# Altium schematic sheet peripherals.schdoc
size 268 x 72 mm
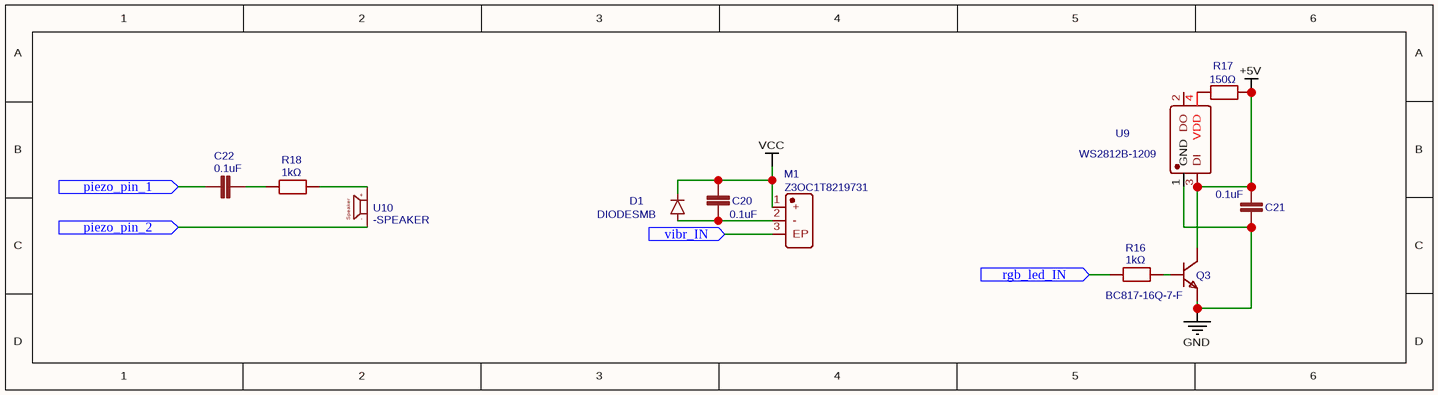
[diagram p0: peripherals.schdoc]

## Parts
C20  0.1uF  [0603-CAP]
C21  0.1uF  [0603-CAP]
C22  0.1uF  [0603-CAP]
D1  DIODESMB  [SMB-DIODE]
M1  Z3OC1T8219731  [VIBRATING-MOTOR-SMD_3P-C9900001680]
Q3  BC817-16Q-7-F  [SOT-23-3_L2.9-W1.3-P1.90-LS2.4-BR]
R16  1kΩ  [R0603]
R17  150Ω  [R0603]
R18  1kΩ  [R0603]
U9  WS2812B-1209  [LED-SMD_4P-L3.2-W2.7-TL-WS2812B-1209]
U10  -SPEAKER  [SPEAKER]

## Ports
piezo_pin_1 (in), piezo_pin_2 (in), rgb_led_IN (in), vibr_IN (in)

## Nets
+5V: C21.1 Q3.3(C) R17.2 U9.3(DI)
GND: C21.2 Q3.2(E) U9.1(GND)
VCC: C20.1 D1.C M1.1(+)
piezo_pin_1: C22.1 ; port piezo_pin_1
piezo_pin_2: U10.NEG ; port piezo_pin_2
rgb_led_IN: R16.2 ; port rgb_led_IN
vibr_IN: M1.3(EP) ; port vibr_IN
NetC20_2: C20.2 D1.A M1.2(-)
NetC22_2: C22.2 R18.2
NetQ3_1: Q3.1(B) R16.1
NetR17_1: R17.1 U9.4(VDD)
NetR18_1: R18.1 U10.POS

Not connected (* = marked no-connect by the designer): U9 2(DO)

## Notes on the sheet
- (in symbol -SPEAKER) +; Speaker; -

## Library data of the parts
C20-C22 = 0.1uF: description: CAP-00810; Contributor: SparkFun; spicePre: C; spiceSymbolName: 0.1UF-25V(+80_-20%)(0603)
D1 = DIODESMB: description: Diode; Contributor: SparkFun; spicePre: D; spiceSymbolName: DIODESMB
M1 = Z3OC1T8219731: BOM_Manufacturer: KOTL(金龙机电); Contributor: LCSC; BOM_Supplier: LCSC; BOM_Supplier Part: C2894731; BOM_Manufacturer Part: Z3OC1T8219731; BOM_JLCPCB Part Class: Extended Part; spicePre: M; spiceSymbolName: Z3OC1T8219731
Q3 = BC817-16Q-7-F: BOM_Manufacturer: Diodes Incorporated; Contributor: LCSC; BOM_Supplier: LCSC; BOM_Supplier Part: C526459; BOM_Manufacturer Part: BC817-16Q-7-F; BOM_JLCPCB Part Class: Extended Part; spicePre: Q; spiceSymbolName: BC817-16Q-7-F
R16 R18 = 1kΩ: BOM_Manufacturer: Resistor.Today; BOM_Manufacturer Part: TCTR0603F47K0F3960T; Contributor: LCSC; BOM_Supplier: LCSC; BOM_Supplier Part: C525388; BOM_JLCPCB Part Class: Extended Part; spicePre: R; spiceSymbolName: TCTR0603F47K0F3960T
R17 = 150Ω: BOM_Manufacturer: Resistor.Today; BOM_Manufacturer Part: TCTR0603F47K0F3960T; Contributor: LCSC; BOM_Supplier: LCSC; BOM_Supplier Part: C525388; BOM_JLCPCB Part Class: Extended Part; spicePre: R; spiceSymbolName: TCTR0603F47K0F3960T
U9 = WS2812B-1209: BOM_Manufacturer: null; Contributor: LCSC; BOM_Supplier: LCSC; BOM_Supplier Part: C2835111; BOM_Manufacturer Part: WS2812B-1209; BOM_JLCPCB Part Class: Extended Part; spicePre: U; spiceSymbolName: WS2812B-1209
U10 = -SPEAKER: spicePre: U; spiceSymbolName: -SPEAKER